# EAGLE design fyp_board_rev3 (EAGLE 9.6.2)
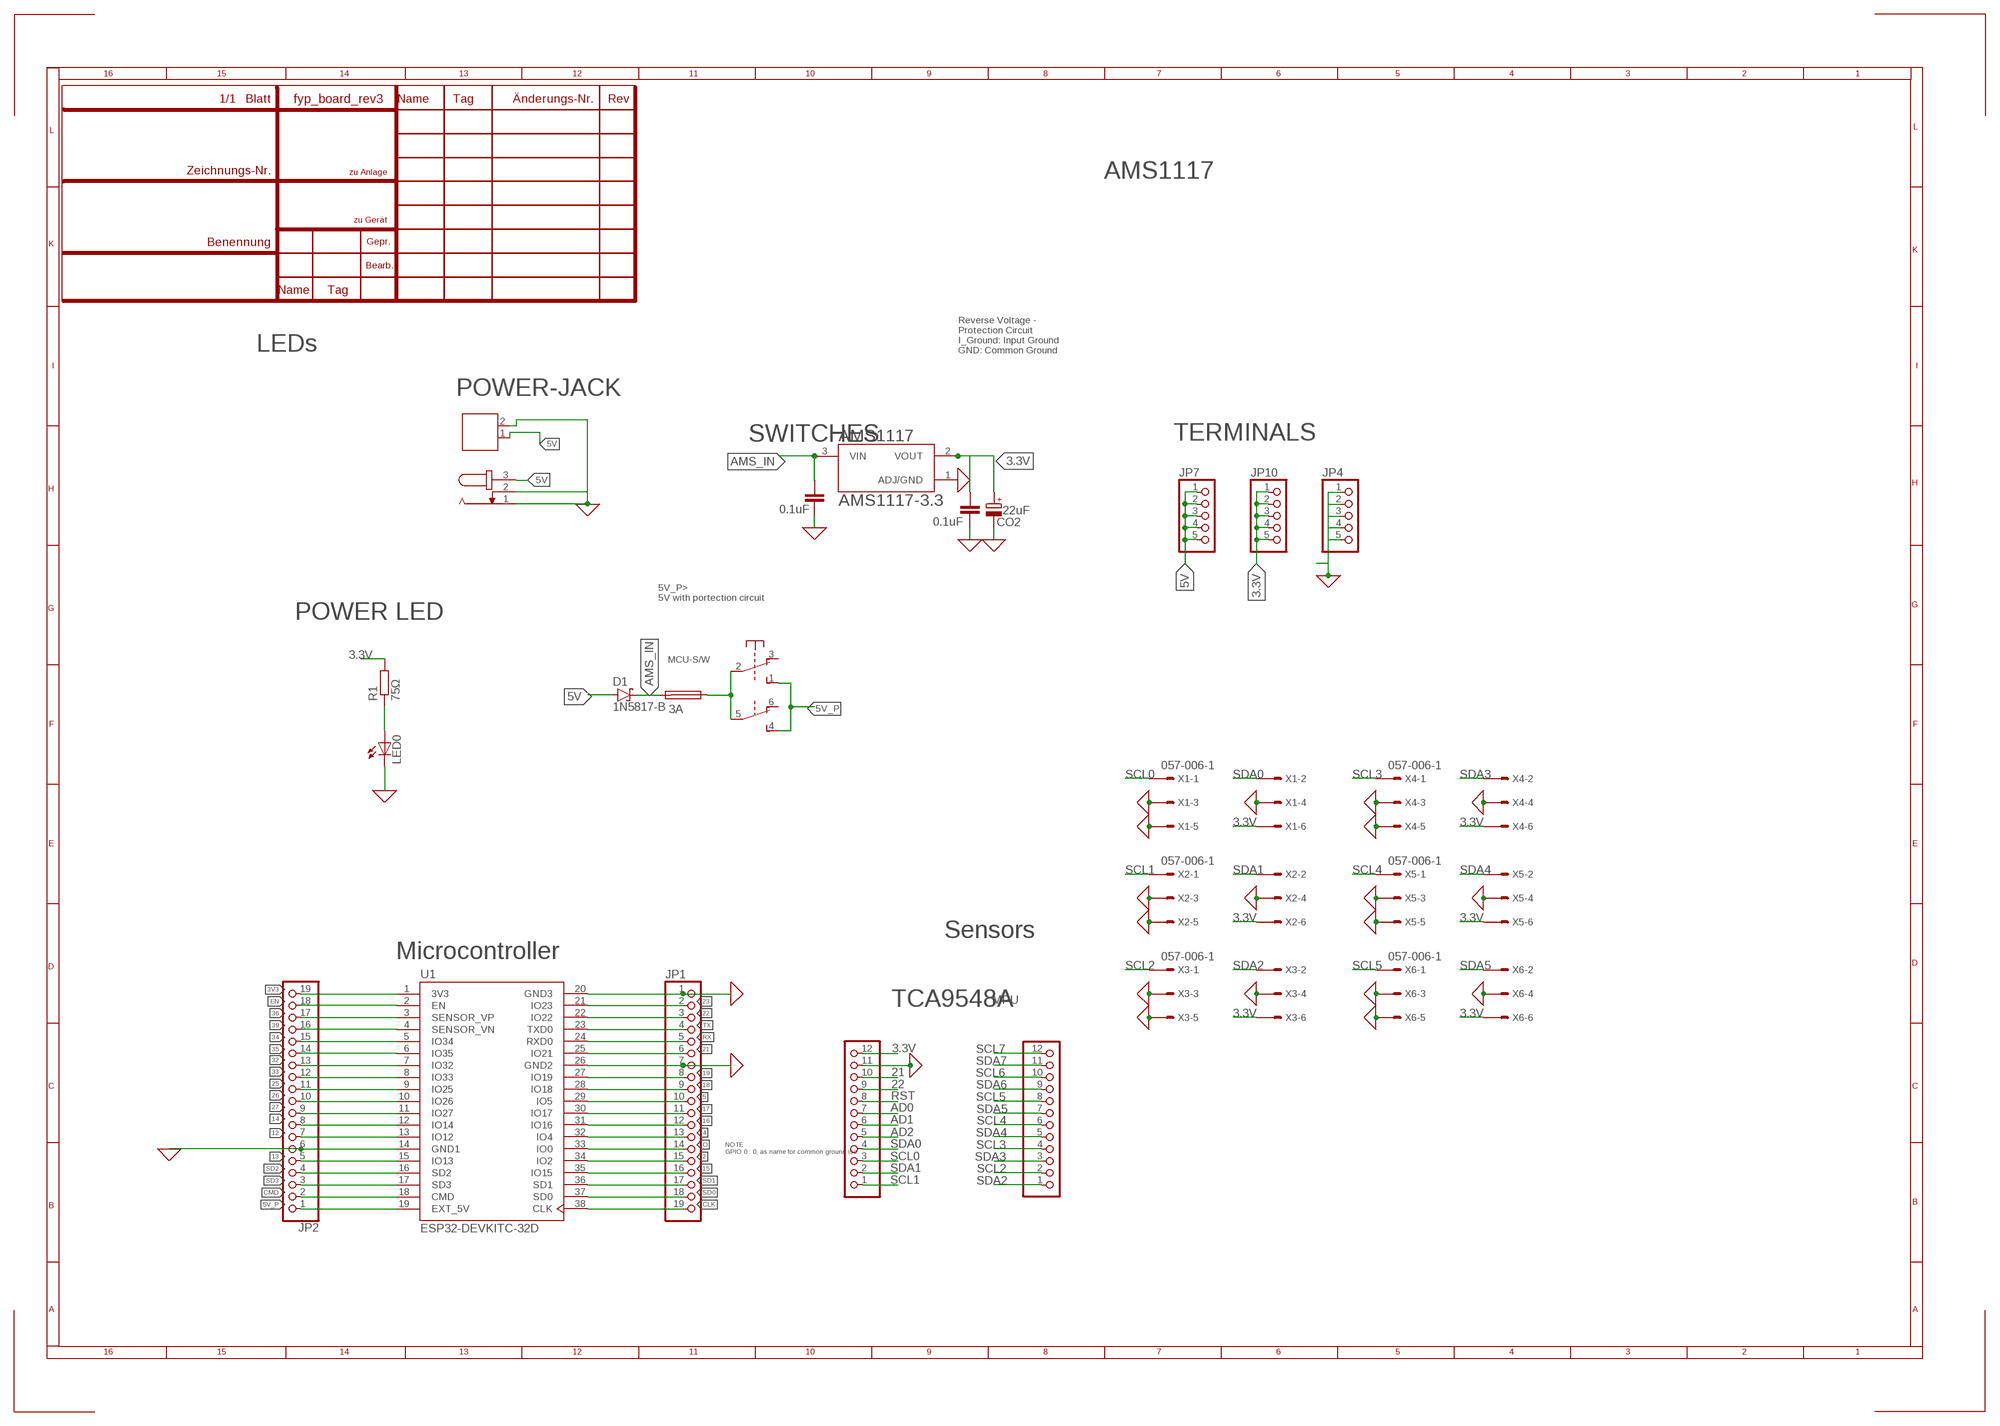
[diagram p0: schematic, sheet 1]

## Parts
12V  691131710002  [691131710002]
AMS1117  AMS1117-3.3  [SOT229P700X180-4N]
CIN1  0.1uF  C5/2.5  [C5B2.5]
CO1  0.1uF  C5/2.5  [C5B2.5]
CO2  22uF  CPOL-EUE2.5-6  [E2,5-6]
D1  1N5817-B  [DO41-7.6]
F2  3A  SH25  [SH25]
JP1  PINHD-1X19  [1X19]
JP2  PINHD-1X19  [1X19]
JP4  PINHD-1X5  [1X05]
JP7  PINHD-1X5  [1X05]
JP10  PINHD-1X5  [1X05]
LED0  LED3MM  [LED3MM]
MCU-S/W  9077-2  [9077-2]
POWER-JACK  JACK-PLUG1  [SPC4078]
R1  75Ω  R-EU_0207/10  [0207/10]
SV2  PINHD-1X12  [1X12]
TCA9548  PINHD-1X12  [1X12]
U1  ESP32-DEVKITC-32D  [MODULE_ESP32-DEVKITC-32D]
X1  057-006-1  [057-006-1]
X2  057-006-1  [057-006-1]
X3  057-006-1  [057-006-1]
X4  057-006-1  [057-006-1]
X5  057-006-1  [057-006-1]
X6  057-006-1  [057-006-1]

## Nets
0: 12V.2 AMS1117.1(ADJ/GND) CIN1.1 CO1.1 CO2.- JP1.1 JP1.7 JP2.6 JP4.1 JP4.2 JP4.3 JP4.4 JP4.5 LED0.K(C) POWER-JACK.1 POWER-JACK.2 TCA9548.11 U1.14(GND1) U1.20(GND3) U1.26(GND2) X1.3 X1.4 X1.5 X2.3 X2.4 X2.5 X3.3 X3.4 X3.5 X4.3 X4.4 X4.5 X5.3 X5.4 X5.5 X6.3 X6.4 X6.5 ; supply symbol labelled GND
2: JP1.15 U1.34(IO2)
3.3V: AMS1117.2(VOUT) CO1.2 CO2.+ JP10.1 JP10.2 JP10.3 JP10.4 JP10.5 R1.2 TCA9548.12 X1.6 X2.6 X3.6 X4.6 X5.6 X6.6
3V3: JP2.19 U1.1(3V3)
4: JP1.13 U1.32(IO4)
5: JP1.10 U1.29(IO5)
5_AF: F2.1 MCU-S/W.2(1:P) MCU-S/W.5(2:P)
5V: 12V.1 D1.A JP7.1 JP7.2 JP7.3 JP7.4 JP7.5 POWER-JACK.3
5V_P: JP2.1 MCU-S/W.1(1:S) MCU-S/W.4(2:S) U1.19(EXT_5V)
12: JP2.7 U1.13(IO12)
13: JP2.5 U1.15(IO13)
14: JP2.8 U1.12(IO14)
15: JP1.16 U1.35(IO15)
16: JP1.12 U1.31(IO16)
17: JP1.11 U1.30(IO17)
18: JP1.9 U1.28(IO18)
19: JP1.8 U1.27(IO19)
21: JP1.6 TCA9548.10 U1.25(IO21)
22: JP1.3 TCA9548.9 U1.22(IO22)
23: JP1.2 U1.21(IO23)
25: JP2.11 U1.9(IO25)
26: JP2.10 U1.10(IO26)
27: JP2.9 U1.11(IO27)
32: JP2.13 U1.7(IO32)
33: JP2.12 U1.8(IO33)
34: JP2.15 U1.5(IO34)
35: JP2.14 U1.6(IO35)
36: JP2.17 U1.3(SENSOR_VP)
39: JP2.16 U1.4(SENSOR_VN)
AD0: TCA9548.7
AD1: TCA9548.6
AD2: TCA9548.5
AMS_IN: AMS1117.3(VIN) CIN1.2 D1.C F2.2
CLK: JP1.19 U1.38(CLK)
CMD: JP2.2 U1.18(CMD)
EN: JP2.18 U1.2(EN)
N$1: LED0.A R1.1
O: JP1.14 U1.33(IO0)
RST: TCA9548.8
RX: JP1.5 U1.24(RXD0)
SCL0: TCA9548.3 X1.1
SCL1: TCA9548.1 X2.1
SCL2: SV2.2 X3.1
SCL3: SV2.4 X4.1
SCL4: SV2.6 X5.1
SCL5: SV2.8 X6.1
SCL6: SV2.10
SCL7: SV2.12
SD0: JP1.18 U1.37(SD0)
SD1: JP1.17 U1.36(SD1)
SD2: JP2.4 U1.16(SD2)
SD3: JP2.3 U1.17(SD3)
SDA0: TCA9548.4 X1.2
SDA1: TCA9548.2 X2.2
SDA2: SV2.1 X3.2
SDA3: SV2.3 X4.2
SDA4: SV2.5 X5.2
SDA5: SV2.7 X6.2
SDA6: SV2.9
SDA7: SV2.11
TX: JP1.4 U1.23(TXD0)
Unconnected: MCU-S/W.3(1:O) MCU-S/W.6(2:O)

## Notes on the sheet
- AMS1117
- LEDs
- Reverse Voltage -
  Protection Circuit
  I_Ground: Input Ground
  GND: Common Ground
- TERMINALS
- SWITCHES
- 5V_P> 
  5V with portection circuit
- POWER LED
- Microcontroller | Sensors
- TCA9548A
- MPU
- NOTE
  GPIO 0 : 0, as name for common ground iso

## Library data of the parts
12V = Wurth_Elektronik_Electromechanic_Terminal_Blocks_Connectors_rev16b:691131710002: WR-TBL Terminal block - CUU5/2 CUU5/2GR - 2 Pins;=>Code : Con_TBL_Screw_PClamp_5.00_6911317100xx_691131710002 <http://katalog.we-online.de/media/images/eican/Con_TBL_Screw_PClamp_5.00_6911317100xx_pf2.jpg> Details see: http://katalog.we-online.de/em/datasheet/6911317100xx.pdf Created 11/23/2014, Karrer Zheng 2014 (C) Wurth Elektronik
AMS1117 = AMS1117-3.3:AMS1117-3.3: Sot223/Pkg 1-Amp 3.3-Volt Low Drop Out Voltage Regulatator; AVAILABILITY: Unavailable; DESCRIPTION: Sot223/Pkg 1-Amp 3.3-Volt Low Drop Out Voltage Regulatator; MF: Advanced Monolithic Systems; MP: AMS1117-3.3; PACKAGE: None; PRICE: None
CIN1 CO1 = capacitor-wima:C: CAPACITOR naming: grid - package width
CO2 = rcl:CPOL-EU: POLARIZED CAPACITOR, European symbol; SPICEPREFIX: C
D1 = diode:1N581*: 1.0A SCHOTTKY BARRIER RECTIFIER Source: http://www.diodes.com/datasheets/ds23001.pdf
F2 = fuse:SH25: FUSE HOLDER grid 25 mm, OGN0031 8211, Schurter (Buerklin); MF: SCHURTER; MPN: 0031.8211; OC_FARNELL: 1162741; OC_NEWARK: 96B9380
JP1 JP2 = pinhead:PINHD-1X19: PIN HEADER
JP4 JP7 JP10 = pinhead_2:PINHD-1X5: PIN HEADER
LED0 = led:LED: LED OSRAM: - CHIPLED LG R971, LG N971, LY N971, LG Q971, LY Q971, LO R971, LY R971 LH N974, LH R974 LS Q976, LO Q976, LY Q976 LO Q996 - Hyper CHIPLED LW Q18S LB Q993, LB Q99A, LB R99A - SideLED LS A670, LO A670, LY A670, LG A670, LP A670 LB A673, LV A673, LT A673, LW A673 LH A674 LY A675 LS A676, LA A676, LO A676, LY A676, LW A676 LS A679, LY A679, LG A679 - Hyper Micro SIDELED® LS Y876, LA Y876, LO Y876, LY Y876 LT Y87S - SmartLED LW L88C, LW L88S LB L89C, LB L89S, LG L890 LS L89K, LO L89K, LY L89K LS L896, LA L896, LO L896, LY L896 - TOPLED LS T670, LO T670, LY T670, LG T670, LP T670 LSG T670, LSP T670, LSY T670, LOP T670, LYG T670 LG T671, LOG T671, LSG T671 LB T673, LV T673, LT T673, LW T673 LH T674 LS T676, LA T676, LO T676, LY T676, LB T676, LH T676, LSB T676, LW T676 LB T67C, LV T67C, LT T67C, LS T67K, LO T67K, LY T67K, LW E67C LS E67B, LA E67B, LO E67B, LY E67B, LB E67C, LV E67C, LT E67C LW T67C LS T679, LY T679, LG T679 LS T770, LO T770, LY T770, LG T770, LP T770 LB T773, LV T773, LT T773, LW T773 LH T774 LS E675, LA E675, LY E675, LS T675 LS T776, LA T776, LO T776, LY T776, LB T776 LHGB T686 LT T68C, LB T68C - Hyper Mini TOPLED® LB M676 - Mini TOPLED Santana® LG M470 LS M47K, LO M47K, LY M47K Source: http://www.osram.convergy.de LUXEON: - LUMILED® LXK2-PW12-R00, LXK2-PW12-S00, LXK2-PW14-U00, LXK2-PW14-V00 LXK2-PM12-R00, LXK2-PM12-S00, LXK2-PM14-U00 LXK2-PE12-Q00, LXK2-PE12-R00, LXK2-PE12-S00, LXK2-PE14-T00, LXK2-PE14-U00 LXK2-PB12-K00, LXK2-PB12-L00, LXK2-PB12-M00, LXK2-PB14-N00, LXK2-PB14-P00, LXK2-PB14-Q00 LXK2-PR12-L00, LXK2-PR12-M00, LXK2-PR14-Q00, LXK2-PR14-R00 LXK2-PD12-Q00, LXK2-PD12-R00, LXK2-PD12-S00 LXK2-PH12-R00, LXK2-PH12-S00 LXK2-PL12-P00, LXK2-PL12-Q00, LXK2-PL12-R00 Source: www.luxeon.com KINGBRIGHT: KA-3528ASYC Source: www.kingbright.com
MCU-S/W = switch-misc:9077-2: MARQUARDT SWITCH 9077.0200 Distributor: Buerklin <https://www.buerklin.com/default.asp?event=ShowArtikel%2812G2822%29&l=d&jump=ArtNr_12G2822>
POWER-JACK = con-jack:JACK-PLUG: DC POWER JACK Power Jack, DC, Right Angle, Through Hole, Rated 5A at 16VDC, PC Terminals Distributor: Farnell (www.Farnell.de) Drawing: 84N1161.pdf / 84N1162.pdf Manufacturer: SPC Technology (www.spctechnology.com) Type: SPC4077 / SPC 4078; OC_FARNELL: unknown; OC_NEWARK: unknown
R1 = resistor:R-EU_: RESISTOR, European symbol
SV2 TCA9548 = pinhead:PINHD-1X12: PIN HEADER
U1 = ESP32-DEVKITC-32D:ESP32-DEVKITC-32D: Eval Board For Esp-Wroom-32; AVAILABILITY: Unavailable; DESCRIPTION: - Transceiver; 802.11 b/g/n _Wi-Fi, WiFi, WLAN_, Bluetooth® Smart Ready 4.x Dual Mode For Use With ESP-WROOM-32; MF: Espressif Systems; MP: ESP32-DEVKITC-32D; PACKAGE: None; PRICE: None
X1-X6 = con-panduit:057-006-: CONNECTOR 6-pin series 057 contact pc board low profile headers; OC_FARNELL: unknown; OC_NEWARK: unknown

## Board
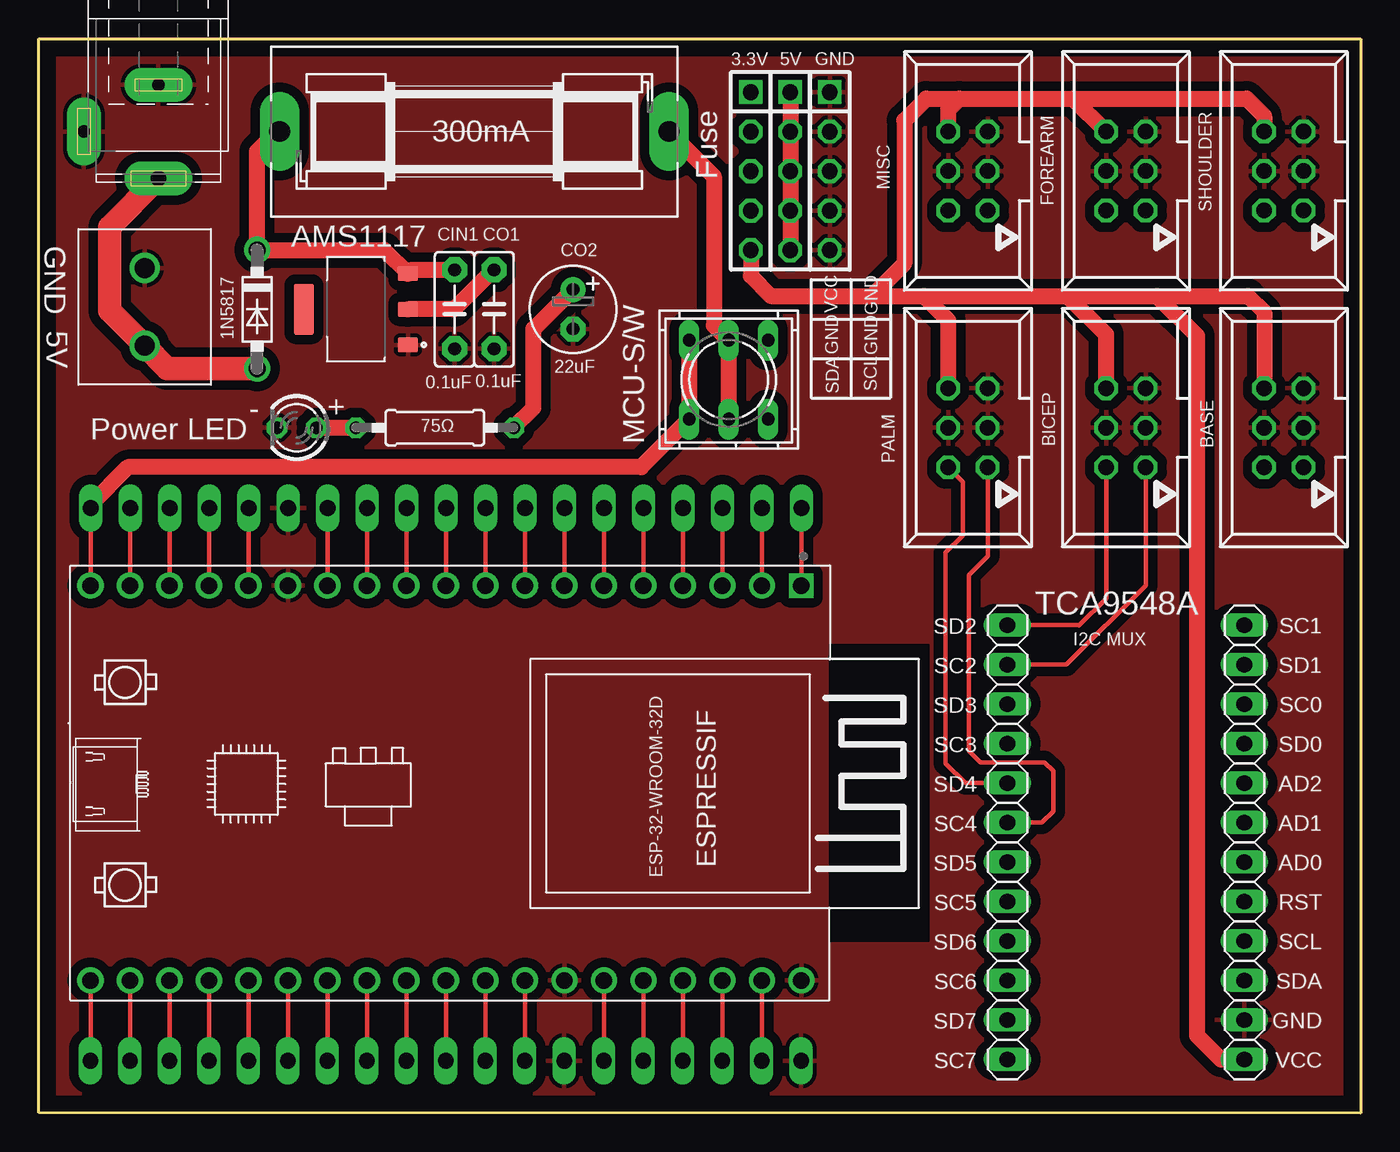
[diagram p1: board, top side]
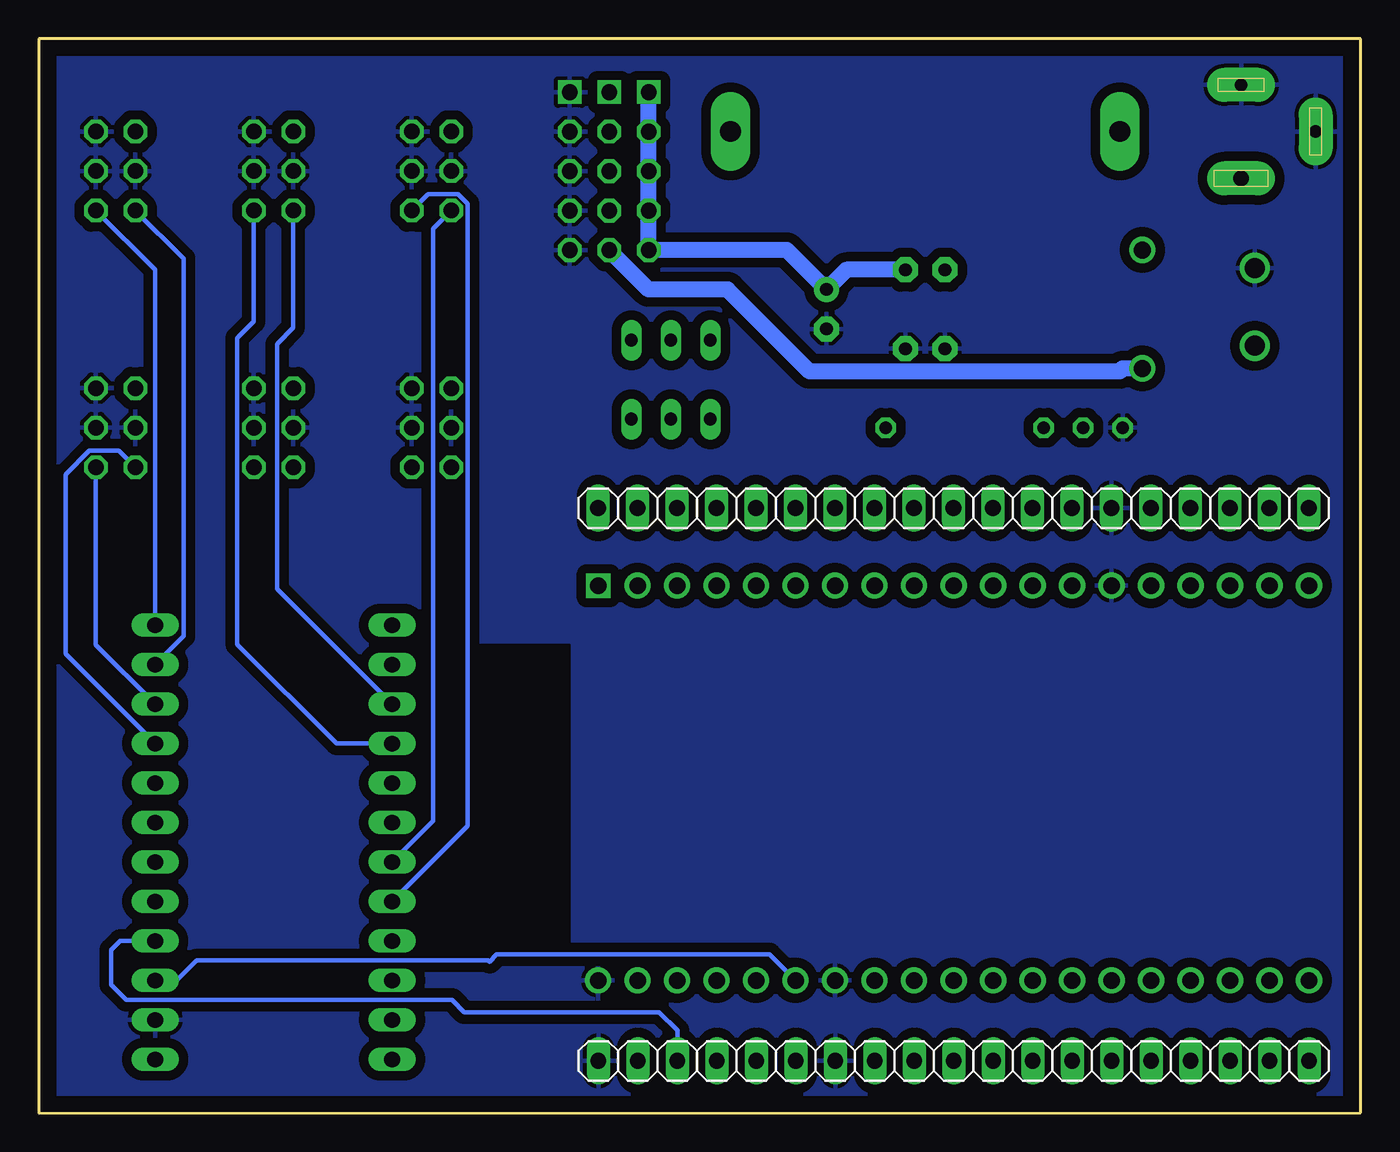
[diagram p2: board, bottom side, seen from below]

Size 85.02 x 69.1 mm. Coordinates in mm from the lower left corner, seen from the top.
Outline: 0,69.1 85.02,69.1 85.02,0 0,0.02 0,69.1
Copper layers (1*16): Top 0.035mm / dielectric 1.5mm / Bottom 0.035mm
Design rules "default": minimum track width 6mil, minimum drill 0.35mm, track to track 6mil, track to pad 6mil, pad to pad 6mil, via to via 6mil, smd to smd 6mil, copper to edge 40mil, drill to drill 6mil, minimum pad ring 10mil, minimum via ring 8mil, stop-mask expansion 4mil, vias tented up to drill 0mil, thermal gap 10mil

### Footprints (pad centres in the part's own frame; a part is rotated, then mirrored left to right if it is on the bottom)
691131710002 = drill 1.3: 1 -2.5,0; 2 2.5,0
SOT229P700X180-4N = smd 0.93 x 1.31: 1 -2.29,-3.345; 2 0,-3.345; 3 2.29,-3.345 | smd 3.24 x 1.31: 4 0,3.345
C5B2.5 = drill 0.813 pad 1.6 octagon: 1 -2.54,0; 2 2.54,0
E2,5-6 = drill 0.813 pad 1.6: + -1.27,0 | drill 0.813 pad 1.6 octagon: - 1.27,0
DO41-7.6 = drill 1.1 pad 1.7: A 3.81,0; C -3.81,0
SH25 = drill 1.321 pad 2.54 long: 1 -12.522,0; 2 12.522,0
1X19 = drill 1.016 long: 1 -22.86,0; 2 -20.32,0; 3 -17.78,0; 4 -15.24,0; 5 -12.7,0; 6 -10.16,0; 7 -7.62,0; 8 -5.08,0; 9 -2.54,0; 10 0,0; 11 2.54,0; 12 5.08,0; 13 7.62,0; 14 10.16,0; 15 12.7,0; 16 15.24,0; 17 17.78,0; 18 20.32,0; 19 22.86,0
1X05 = drill 1.016 square: 1 -5.08,0 | drill 1.016 octagon: 2 -2.54,0; 3 0,0; 4 2.54,0; 5 5.08,0
LED3MM = drill 0.813 octagon: A -1.27,0; K 1.27,0
9077-2 = drill 0.813 long: 1 -2.54,2.54; 2 0,2.54; 3 2.54,2.54; 4 -2.54,-2.54; 5 0,-2.54; 6 2.54,-2.54
SPC4078 = drill 0.8 pad 2.184 long: 1 -3,0; 2 0,-4.8 | drill 1 pad 2.184 long: 3 3,0
0207/10 = drill 0.813 octagon: 1 -5.08,0; 2 5.08,0
1X12 = drill 1.016 long: 1 -13.97,0; 2 -11.43,0; 3 -8.89,0; 4 -6.35,0; 5 -3.81,0; 6 -1.27,0; 7 1.27,0; 8 3.81,0; 9 6.35,0; 10 8.89,0; 11 11.43,0; 12 13.97,0
MODULE_ESP32-DEVKITC-32D = drill 1.04 square: 1 -12.7,19.76 | drill 1.04 pad 1.676: 2 -12.7,17.22; 3 -12.7,14.68; 4 -12.7,12.14; 5 -12.7,9.6; 6 -12.7,7.06; 7 -12.7,4.52; 8 -12.7,1.98; 9 -12.7,-0.56; 10 -12.7,-3.1; 11 -12.7,-5.64; 12 -12.7,-8.18; 13 -12.7,-10.72; 14 -12.7,-13.26; 15 -12.7,-15.8; 16 -12.7,-18.34; 17 -12.7,-20.88; 18 -12.7,-23.42; 19 -12.7,-25.96; 20 12.7,19.76; 21 12.7,17.22; 22 12.7,14.68; 23 12.7,12.14; 24 12.7,9.6; 25 12.7,7.06; 26 12.7,4.52; 27 12.7,1.98; 28 12.7,-0.56; 29 12.7,-3.1; 30 12.7,-5.64; 31 12.7,-8.18; 32 12.7,-10.72; 33 12.7,-13.26; 34 12.7,-15.8; 35 12.7,-18.34; 36 12.7,-20.88; 37 12.7,-23.42; 38 12.7,-25.96
057-006-1 = drill 1 octagon: 1 -2.54,-1.27; 2 -2.54,1.27; 3 0,-1.27; 4 0,1.27; 5 2.54,-1.27; 6 2.54,1.27

### Placement (x,y rotation side)
12V  6.81,51.86 90 top
AMS1117  20.39,51.7 90 top
CIN1  26.74,51.7 90 top
CO1  29.28,51.7 90 top
CO2  34.36,51.7 270 top
D1  14.04,51.7 270 top
F2  28.01,63.13 180 top
JP1  26.17,3.36 0 bottom
JP2  26.19,38.91 180 bottom
JP4  50.87,60.59 270 top
JP7  48.33,60.59 270 top
JP10  45.79,60.59 270 top
LED0  16.58,44.09 180 top
MCU-S/W  44.37,47.18 0 top
POWER-JACK  7.69,63.13 270 top
R1  25.47,44.09 0 top
SV2  62.3,17.41 270 top
TCA9548  77.54,17.41 270 top
U1  29.28,21.23 270 top
X1  80.08,44.09 90 top
X2  80.08,60.59 90 top
X3  69.92,44.09 90 top
X4  69.92,60.59 90 top
X5  59.76,44.09 90 top
X6  59.76,60.59 90 top

### Tracks (layer width: path | path; a pad name or v marks a point on that pad's centre or on a via)
0
  cutout Top: 50.87,30.12 50.87,11.06 57.22,11.06 57.22,30.12
  cutout Bottom: 50.87,30.12 57.22,30.12 57.22,11.06 50.87,11.06
  pour Top (isolate 0.61, rank 2): -1.2,69.48 85.16,69.48 85.16,-0.37 -1.2,-0.37
  pour Bottom (isolate 0.61, rank 2): -1.2,69.48 85.16,69.48 85.16,-0.37 -1.2,-0.37
2
  Top 0.305: U1.34 JP1.15
3.3V
  Top 1.016: R1.2 31.82,45.35 31.82,50.44 CO2.+ | CO1.2 29.24,54.24 26.69,51.7 AMS1117.2 | X6.6 58.49,64.55 59.21,65.27 | 59.21,65.27 66.52,65.27 | 66.52,65.27 77.69,65.27 78.81,64.14 X2.6 | 66.52,65.27 X4.6 | JP10.5 45.79,53.85 47.08,52.56 53.58,52.56 | X1.6 78.81,51.52 77.76,52.56 71.91,52.56 | 53.58,52.56 56.91,52.56 | 56.91,52.56 66.16,52.56 | 66.16,52.56 71.91,52.56 | 53.58,52.56 55.66,54.65 55.66,63.84 57.09,65.27 59.21,65.27 | X5.6 58.49,50.99 56.91,52.56 | X3.6 68.65,50.08 66.16,52.56 | 71.91,52.56 74.5,49.98 74.5,4.97 76.03,3.44 TCA9548.12
  Bottom 1.016: CO1.2 33.09,54.24 CO2.+ 36.9,55.52 JP10.5 JP10.4 JP10.3 JP10.2 JP10.1
3V3
  Top 0.305: JP2.19 U1.1
4
  Top 0.305: U1.32 JP1.13
5
  Top 0.305: U1.29 JP1.10
5_AF
  Top 1.016: MCU-S/W.5 MCU-S/W.2 43.42,50.67 43.42,60.25 F2.1
5V
  Top 1.016: JP7.1 JP7.2 JP7.3 JP7.4 JP7.5
  Top 1.5: D1.A 8.27,47.9 12V.1 4.54,51.62 4.54,56.99 POWER-JACK.3
  Bottom 1.016: D1.A 15.31,47.9 15.5,47.7 35.44,47.7 40.71,52.98 45.79,52.98 JP7.5
5V_P
  Top 0.305: JP2.1 U1.19
  Top 1.016: MCU-S/W.1 MCU-S/W.4 38.74,41.55 5.73,41.55 3.33,39.15 JP2.1
12
  Top 0.305: JP2.7 U1.13
13
  Top 0.305: JP2.5 U1.15
14
  Top 0.305: JP2.8 U1.12
15
  Top 0.305: U1.35 JP1.16
16
  Top 0.305: U1.31 JP1.12
17
  Top 0.305: U1.30 JP1.11
18
  Top 0.305: U1.28 JP1.9
19
  Top 0.305: U1.27 JP1.8
21
  Top 0.305: JP1.6 U1.25
  Bottom 0.305: TCA9548.10 76.15,8.53 74.85,9.82 56.12,9.82 56.04,9.73 55.58,10.2 38.01,10.2 U1.25
22
  Top 0.305: U1.22 JP1.3
  Bottom 0.305: JP1.3 43.96,5.31 45.13,6.48 57.66,6.48 58.46,7.28 79.4,7.28 80.35,8.23 80.35,10.48 79.78,11.06 TCA9548.9
23
  Top 0.305: U1.21 JP1.2
25
  Top 0.305: JP2.11 U1.9
26
  Top 0.305: JP2.10 U1.10
27
  Top 0.305: JP2.9 U1.11
32
  Top 0.305: JP2.13 U1.7
33
  Top 0.305: JP2.12 U1.8
34
  Top 0.305: JP2.15 U1.5
35
  Top 0.305: JP2.14 U1.6
36
  Top 0.305: JP2.17 U1.3
39
  Top 0.305: JP2.16 U1.4
AMS_IN
  Top 0.152: 15.31,63.13 F2.2
  Top 1.016: 15.31,63.13 14.04,61.87 D1.C 22.22,55.52 AMS1117.3 23.99,54.24 CIN1.2
CLK
  Top 0.305: U1.38 JP1.19
CMD
  Top 0.305: JP2.2 U1.18
EN
  Top 0.305: JP2.18 U1.2
N$1
  Top 1.016: LED0.A R1.1
O
  Top 0.305: U1.33 JP1.14
RX
  Top 0.305: U1.24 JP1.5
SCL0
  Bottom 0.305: X1.1 81.35,30.12 TCA9548.3
SCL1
  Bottom 0.305: TCA9548.1 77.54,54.24 X2.1
SCL2
  Top 0.305: X3.1 71.19,33.95 66.09,28.84 SV2.2
SCL3
  Bottom 0.305: X4.1 71.19,50.9 72.25,49.84 72.25,30.14 65.88,23.77 SV2.4
SCL4
  Top 0.305: X5.1 61.03,35.84 59.82,34.62 59.82,23.31 60.56,22.57 64.67,22.57 65.25,22 65.25,19.4 64.53,18.68 SV2.6
SCL5
  Bottom 0.305: X6.1 59.97,59.11 58.05,59.11 57.43,58.49 57.43,18.47 SV2.8
SD0
  Top 0.305: U1.37 JP1.18
SD1
  Top 0.305: U1.36 JP1.17
SD2
  Top 0.305: JP2.4 U1.16
SD3
  Top 0.305: JP2.3 U1.17
SDA0
  Bottom 0.305: X1.2 79.87,42.6 81.79,42.6 83.3,41.09 83.3,29.53 TCA9548.4
SDA1
  Bottom 0.305: TCA9548.2 75.71,30.67 75.71,54.96 X2.2
SDA2
  Top 0.305: X3.2 68.65,33.11 66.9,31.36 66.88,31.39 SV2.1
SDA3
  Bottom 0.305: X4.2 68.65,50.51 69.71,49.45 69.71,33.71 SV2.3
SDA4
  Top 0.305: SV2.5 59.59,21.23 58.31,22.5 58.31,36.05 59.43,37.16 59.43,40.6 X5.2
SDA5
  Bottom 0.305: X6.2 59.66,56.88 59.66,18.78 SV2.7
TX
  Top 0.305: U1.23 JP1.4

### Text on the board
tNames: 3.3V | 5V | GND | 300mA | Fuse | MISC | FOREARM | SHOULDER | CIN1 | CO1 | GND | AMS1117 | CO2 | VCC | GND | 5V | 1N5817 | GND | GND | 22uF | 0.1uF | 0.1uF | SDA | SCL | - | + | Power LED | 75Ω | MCU-S/W | BICEP | BASE | PALM | TCA9548A | SD2 | SC1 | I2C MUX | SC2 | SD1 | SD3 | SC0 | SC3 | SD0 | SD4 | AD2 | SC4 | AD1 | SD5 | AD0 | SC5 | RST | SD6 | SCL | SC6 | SDA | SD7 | GND | SC7 | VCC